# EAGLE design Rev1_1 (EAGLE 6.3)
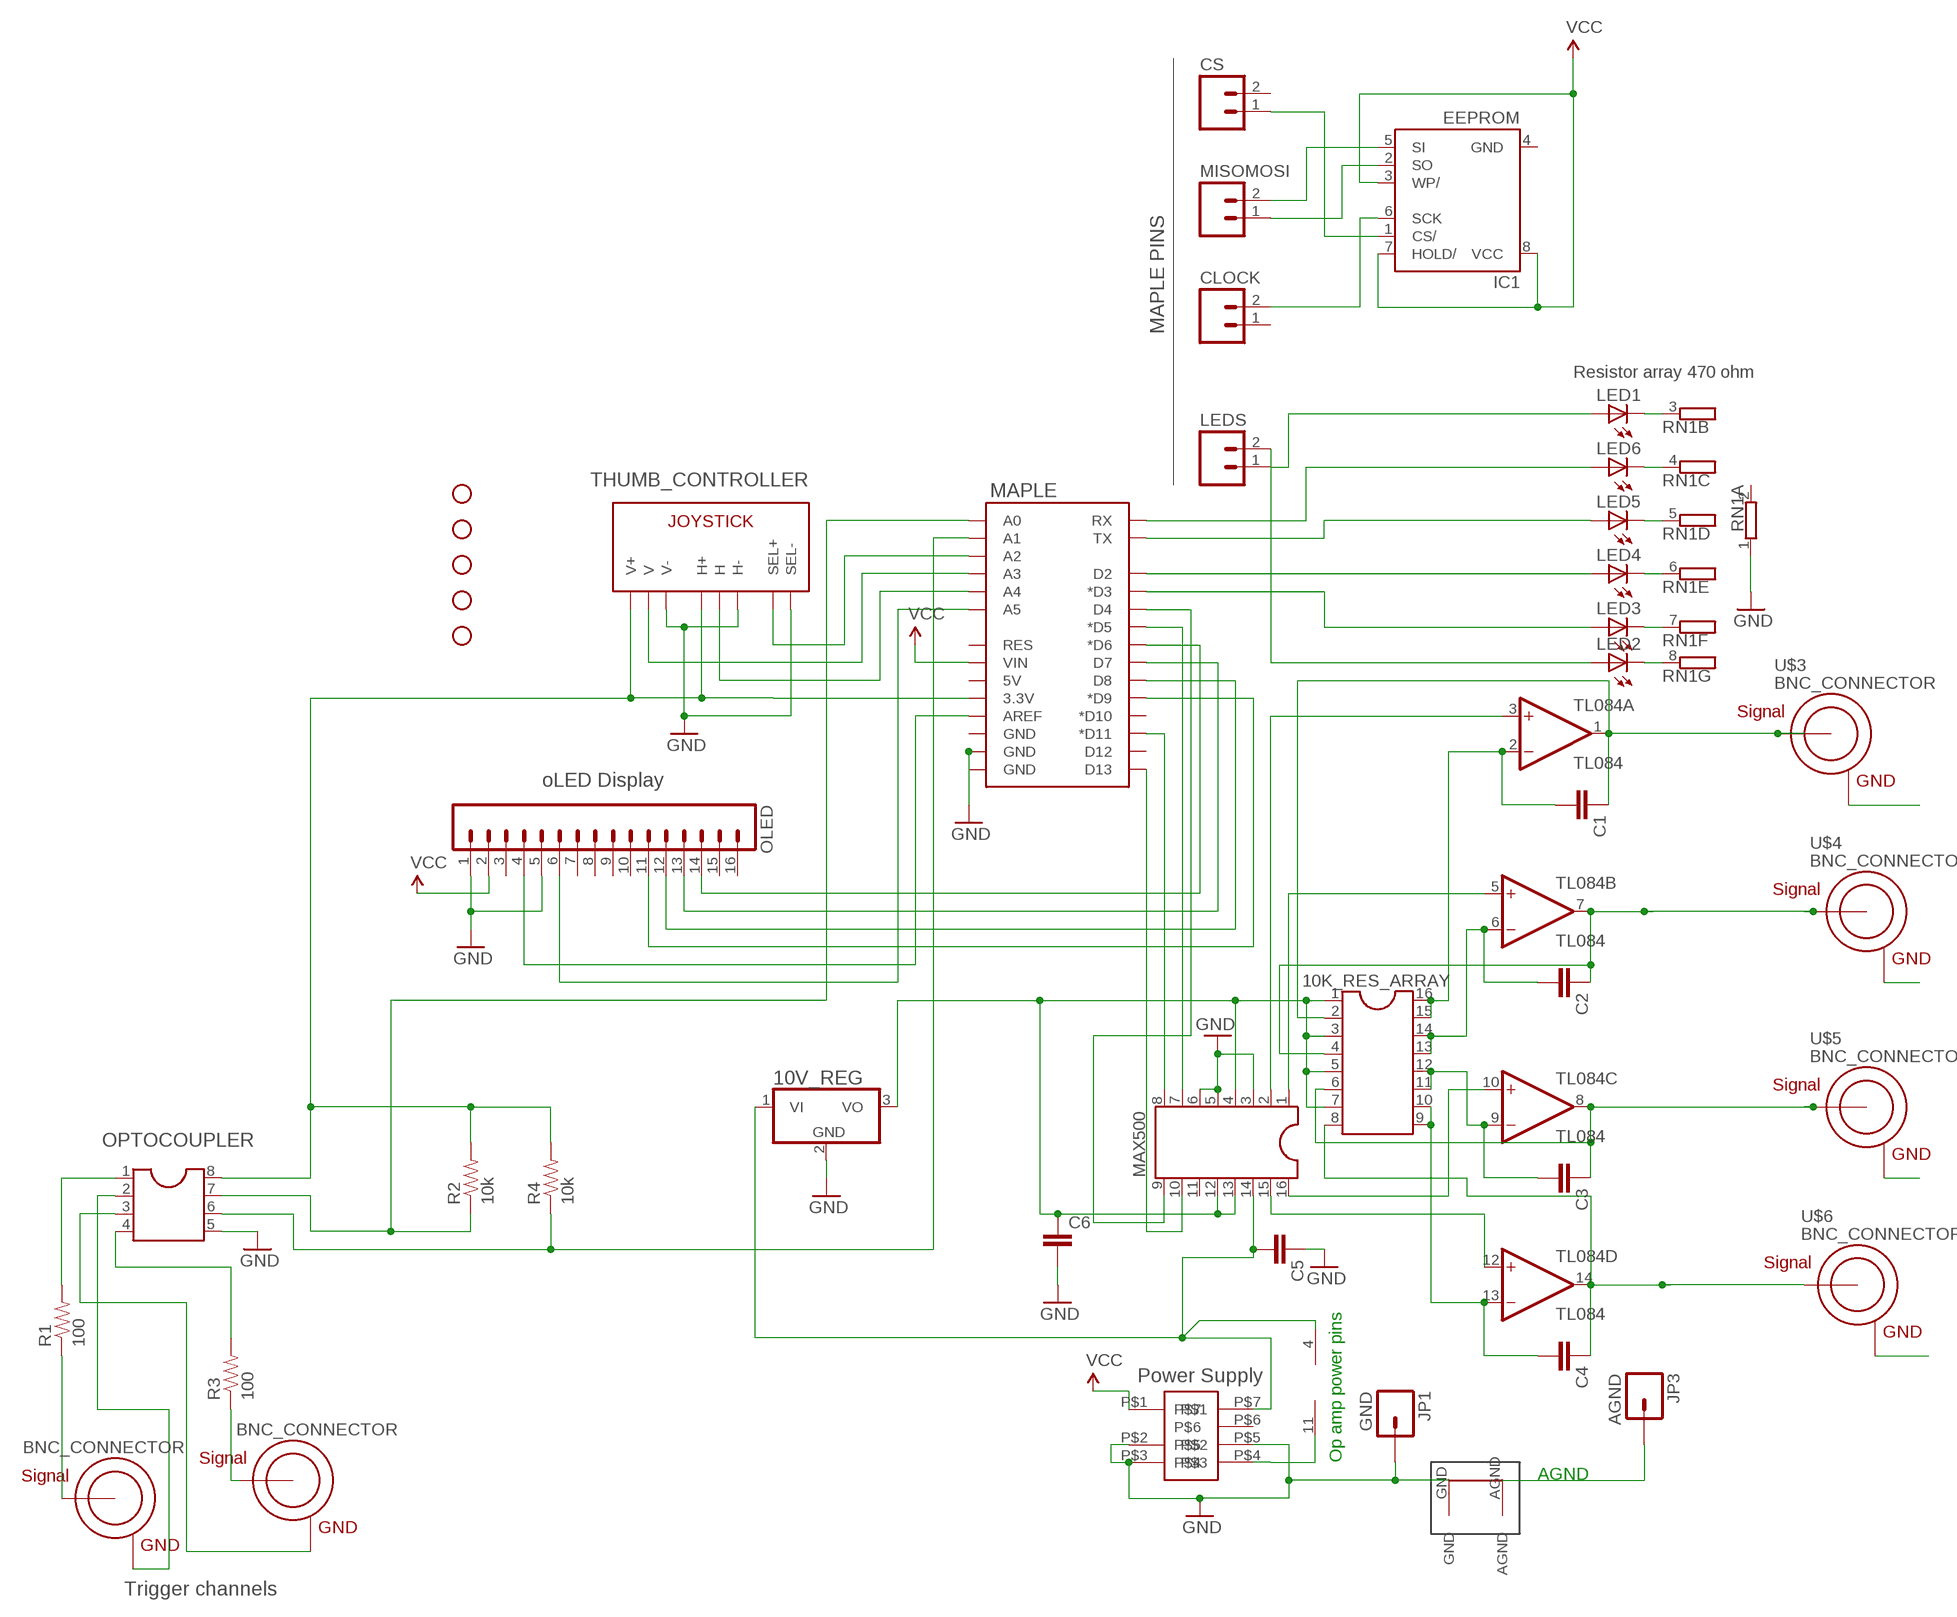
[diagram p0: schematic, sheet 1]

## Parts
10K_RES_ARRAY  DIL16  [DIL16]
10V_REG  7805T  [TO220H]
C1  CAPPTH  [CAP-PTH-SMALL]
C2  CAPPTH  [CAP-PTH-SMALL]
C3  CAPPTH  [CAP-PTH-SMALL]
C4  CAPPTH  [CAP-PTH-SMALL]
C5  CAPPTH  [CAP-PTH-SMALL]
C6  CAPPTH  [CAP-PTH-SMALL]
CLOCK  M02PTH  [1X02]
CS  M02PTH  [1X02]
IC1  EEPROM  AT25P  [DIL08]
JP1  GND  M01PTH  [1X01]
JP2  STAND-OFF  [STAND-OFF]
JP3  AGND  M01PTH  [1X01]
JP5  STAND-OFF  [STAND-OFF]
JP6  STAND-OFF  [STAND-OFF]
JP8  STAND-OFF  [STAND-OFF]
JP9  STAND-OFF  [STAND-OFF]
LED1  LED3MM  [LED3MM]
LED2  LED3MM  [LED3MM]
LED3  LED3MM  [LED3MM]
LED4  LED3MM  [LED3MM]
LED5  LED3MM  [LED3MM]
LED6  LED3MM  [LED3MM]
LEDS  M02PTH  [1X02]
MAPLE  ARDUINO_SHIELDNOHOLESORLABELS  [DUEMILANOVE_SHIELD_NOHOLES_NOLABELS]
MAX500  DIL16  [DIL16]
MISOMOSI  M02PTH  [1X02]
OLED  M16PTH  [1X16]
OPTOCOUPLER  DIL8  [DIL08]
R1  100  RESISTORAXIAL-0.3  [AXIAL-0.3]
R2  10k  RESISTORAXIAL-0.3  [AXIAL-0.3]
R3  100  RESISTORAXIAL-0.3  [AXIAL-0.3]
R4  10k  RESISTORAXIAL-0.3  [AXIAL-0.3]
RN1  GE07R  [SIL8]
THUMB_CONTROLLER  JOYSTICKPTH  [JOYSTICK]
TL084  TL084  TL084P  [DIL14]
U$1  BNC_CONNECTOR  [BNC_CONNECTOR]
U$2  BNC_CONNECTOR  [BNC_CONNECTOR]
U$3  BNC_CONNECTOR  [BNC_CONNECTOR]
U$4  BNC_CONNECTOR  [BNC_CONNECTOR]
U$5  BNC_CONNECTOR  [BNC_CONNECTOR]
U$6  BNC_CONNECTOR  [BNC_CONNECTOR]
U$7  GNDPLANESHRT  [GNDPLANESHRT]
U$8  TDK_LAMBDA_5_TO_BI_12_125MA  [TDK_LAMBDA_5_TO_BI_12_125MA]

## Nets
AGND: JP3.1 U$3.GND U$4.GND U$5.GND U$6.GND U$7.AGND
GND: 10V_REG.2(GND) C5.1 C6.2 JP1.1 MAPLE.GND@0(GND) MAPLE.GND@1(GND) MAX500.3 MAX500.5 MAX500.6 OLED.1 OLED.5 OPTOCOUPLER.5 RN1.1 THUMB_CONTROLLER.B2A(SEL-) THUMB_CONTROLLER.H3(H-) THUMB_CONTROLLER.V3(V-) U$7.GND U$8.P$2 U$8.P$3 U$8.P$5
N$1: LED6.A MAPLE.RX
N$2: LED5.A MAPLE.TX
N$3: LED4.A MAPLE.D2
N$4: LED3.A MAPLE.D3(*D3)
N$5: MAPLE.D11(*D11) MAX500.8
N$6: MAPLE.D13 MAX500.10
N$7: MAPLE.AREF OLED.4
N$8: MAPLE.D4 MAX500.9
N$9: MAPLE.D5(*D5) MAX500.7
N$10: MAPLE.D6(*D6) OLED.14
N$11: MAPLE.D7 OLED.13
N$12: MAPLE.D8 OLED.12
N$13: MAPLE.D9(*D9) OLED.11
N$14: MAPLE.A5 OLED.6
N$15: MAPLE.A4 THUMB_CONTROLLER.H2(H)
N$16: MAPLE.A3 THUMB_CONTROLLER.V2(V)
N$17: MAPLE.A2 THUMB_CONTROLLER.B1A(SEL+)
N$19: R1.P$1 U$1.SIGNAL
N$20: MAPLE.A0 OPTOCOUPLER.7 R2.P$1
N$21: R3.P$1 U$2.SIGNAL
N$22: MAPLE.A1 OPTOCOUPLER.6 R4.P$1
N$23: TL084.11(P:V-) U$8.P$4
N$24: MAX500.2 TL084.3(A:+IN)
N$25: MAX500.1 TL084.5(B:+IN)
N$28: 10V_REG.1(VI) C5.2 MAX500.14 TL084.4(P:V+) U$8.P$7
N$29: 10K_RES_ARRAY.1 10K_RES_ARRAY.3 10K_RES_ARRAY.5 10K_RES_ARRAY.7 10V_REG.3(VO) C6.1 MAX500.4 MAX500.12 MAX500.13
N$30: MAX500.16 TL084.10(C:+IN)
N$31: MAX500.15 TL084.12(D:+IN)
N$32: 10K_RES_ARRAY.2 C1.1 TL084.1(A:OUT) U$3.SIGNAL
N$33: 10K_RES_ARRAY.4 C2.1 TL084.7(B:OUT) U$4.SIGNAL
N$34: 10K_RES_ARRAY.6 C3.1 TL084.8(C:OUT) U$5.SIGNAL
N$35: 10K_RES_ARRAY.8 C4.1 TL084.14(D:OUT) U$6.SIGNAL
N$36: LED1.A LEDS.1
N$37: LED2.A LEDS.2
N$38: LED2.K(C) RN1.8
N$39: LED3.K(C) RN1.7
N$40: LED4.K(C) RN1.6
N$41: LED5.K(C) RN1.5
N$42: LED6.K(C) RN1.4
N$43: 10K_RES_ARRAY.15 10K_RES_ARRAY.16 C1.2 TL084.2(A:-IN)
N$44: 10K_RES_ARRAY.13 10K_RES_ARRAY.14 C2.2 TL084.6(B:-IN)
N$45: 10K_RES_ARRAY.11 10K_RES_ARRAY.12 C3.2 TL084.9(C:-IN)
N$46: 10K_RES_ARRAY.9 10K_RES_ARRAY.10 C4.2 TL084.13(D:-IN)
N$47: LED1.K(C) RN1.3
N$52: OPTOCOUPLER.1 R1.P$2
N$53: CS.1 IC1.1(CS/)
N$54: IC1.5(SI) MISOMOSI.2
N$55: IC1.2(SO) MISOMOSI.1
N$56: CLOCK.2 IC1.6(SCK)
N$57: OPTOCOUPLER.2 U$1.GND
N$58: OPTOCOUPLER.4 R3.P$2
N$60: OPTOCOUPLER.3 U$2.GND
N$61: MAPLE.3.3V OPTOCOUPLER.8 R2.P$2 R4.P$2 THUMB_CONTROLLER.H1(H+) THUMB_CONTROLLER.V1(V+)
VCC: IC1.3(WP/) IC1.7(HOLD/) IC1.8(VCC) MAPLE.VIN OLED.2 U$8.P$1
Unconnected: CLOCK.1 CS.2 MAPLE.5V MAPLE.D10(*D10) MAPLE.D12 MAPLE.GND@2(GND) MAPLE.RES MAX500.11 OLED.3 OLED.7 OLED.8 OLED.9 OLED.10 OLED.15 OLED.16 RN1.2 U$8.P$6

## Notes on the sheet
- MAPLE PINS
- Resistor array 470 ohm
- oLED Display
- Power Supply
- Op amp power pins
- AGND
- Trigger channels

## Power pins joined to a net without a drawn wire
GND: IC1.4(GND)

## Library data of the parts
10K_RES_ARRAY MAX500 = ic-package:DIL16: Dual In Line / Socket
10V_REG = linear:78*: Positive VOLTAGE REGULATOR Source: http://cache.national.com/ds/LM/LM78L05.pdf http://www.fairchildsemi.com/ds/LM/LM7805.pdf
C1-C6 = SparkFun:CAP: Capacitor Standard 0603 ceramic capacitor, and 0.1" leaded capacitor.
CLOCK CS LEDS MISOMOSI = SparkFun:M02: Header 2 Standard 2-pin 0.1" header. Use with straight break away headers (SKU : PRT-00116), right angle break away headers (PRT-00553), swiss pins (PRT-00743), machine pins (PRT-00117), and female headers (PRT-00115). Molex polarized connector foot print use with SKU : PRT-08233 with associated crimp pins and housings.
IC1 = atmel:AT25*: SPI bus serial EEPROM
JP1 JP3 = SparkFun-Connectors:M01: Header 1 Standard 1-pin 0.1" header. Use with straight break away headers (SKU : PRT-00116), right angle break away headers (PRT-00553), swiss pins (PRT-00743), machine pins (PRT-00117), and female headers (PRT-00115). SMTSO-256-ET is a "flush mount" nut for a 4-40 screw. The older package used to be too tight, and did not allow it to sit properly thru the drill hit. The latest (0.165DIA) fits nice and snug.
JP2 JP5 JP6 JP8 JP9 = SparkFun:STAND-OFF: Stand Off This is the mechanical footprint for a #4 phillips button head screw. Use the keepout ring to avoid running the screw head into surrounding components. SKU : PRT-00447
LED1-LED6 = SparkFun:LED: LEDs Standard schematic elements and footprints for 5mm, 3mm, 1206, and 0603 sized LEDs. 5mm - Spark Fun Electronics SKU : COM-00529 (and others)
MAPLE = SparkFun:ARDUINO_SHIELD
OLED = SparkFun:M16
OPTOCOUPLER = ic-package:DIL8: Dual In Line / Socket
R1-R4 = SparkFun:RESISTOR: Resistor Basic schematic elements and footprints for 0603, 1206, and PTH resistors.
RN1 = resistor-sil:GE07R: SIL RESISTOR
THUMB_CONTROLLER = SparkFun:JOYSTICK: Thumb Joystick Joystick commonly found in PS2 controllers. Two pots and a select switch. Footprint proven. Spark Fun Electronics SKU : COM-09032
TL084 = linear:TL084: OP AMP
U$1-U$6 = JoshParts:BNC_CONNECTOR
U$7 = Joshparts2:GNDPLANESHRT
U$8 = JoshParts:TDK_LAMBDA_5_TO_BI_12_125MA

## Net classes
0 default: width 0.203 mm
1 vcc: width 0.254 mm

## Board
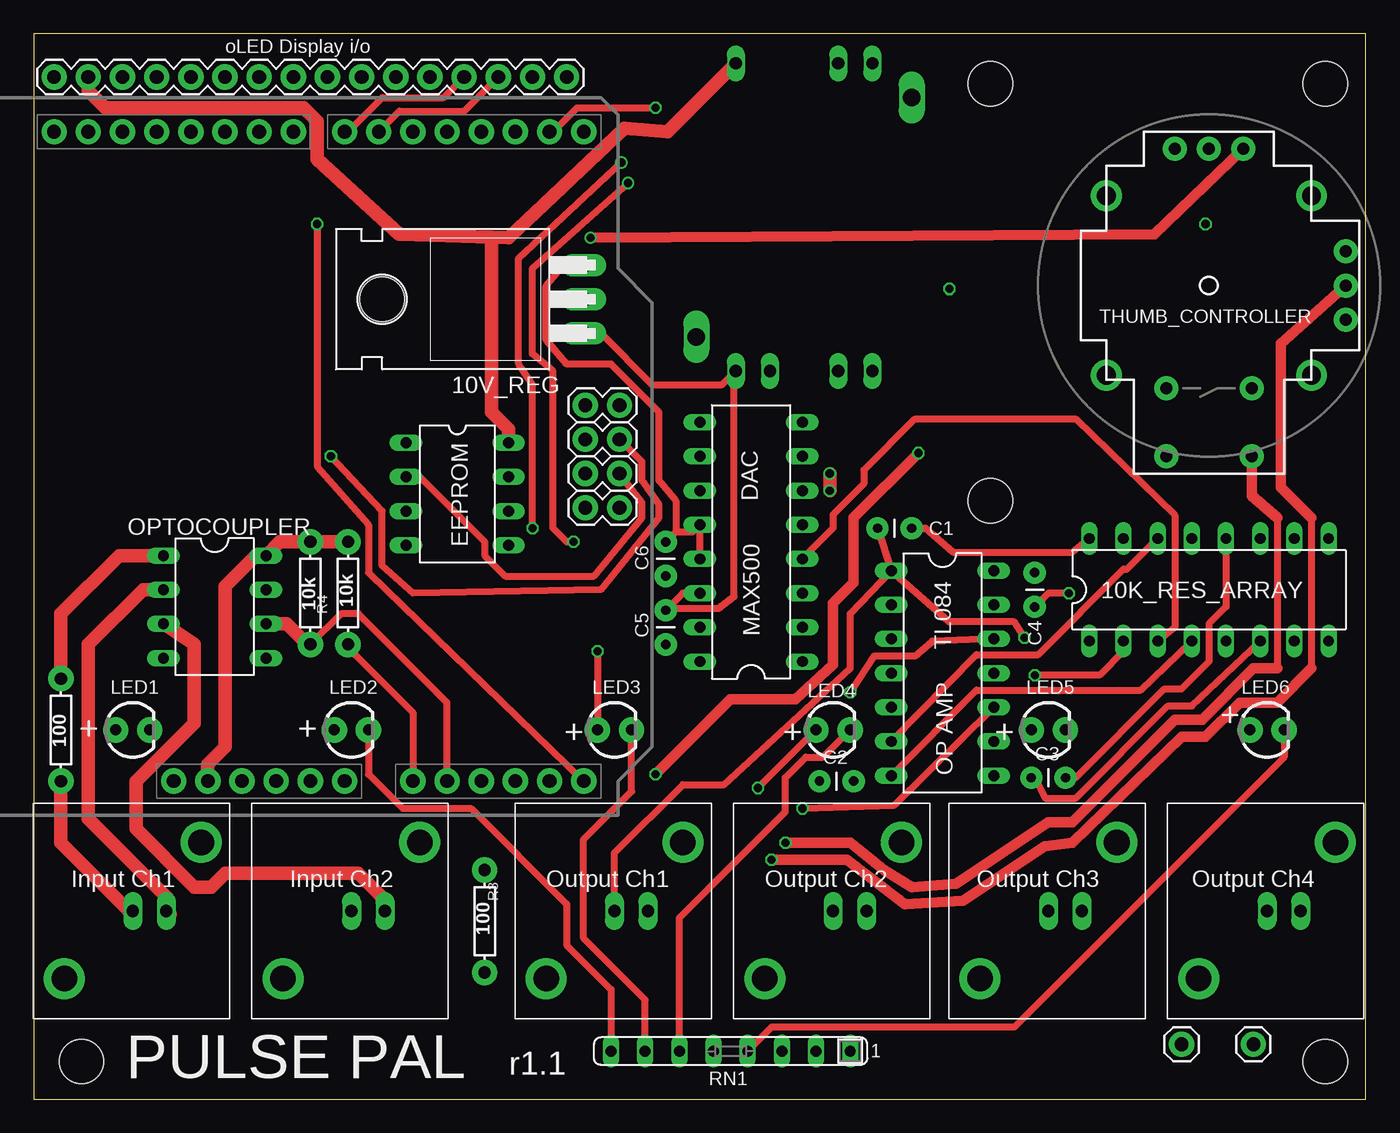
[diagram p1: board, top side]
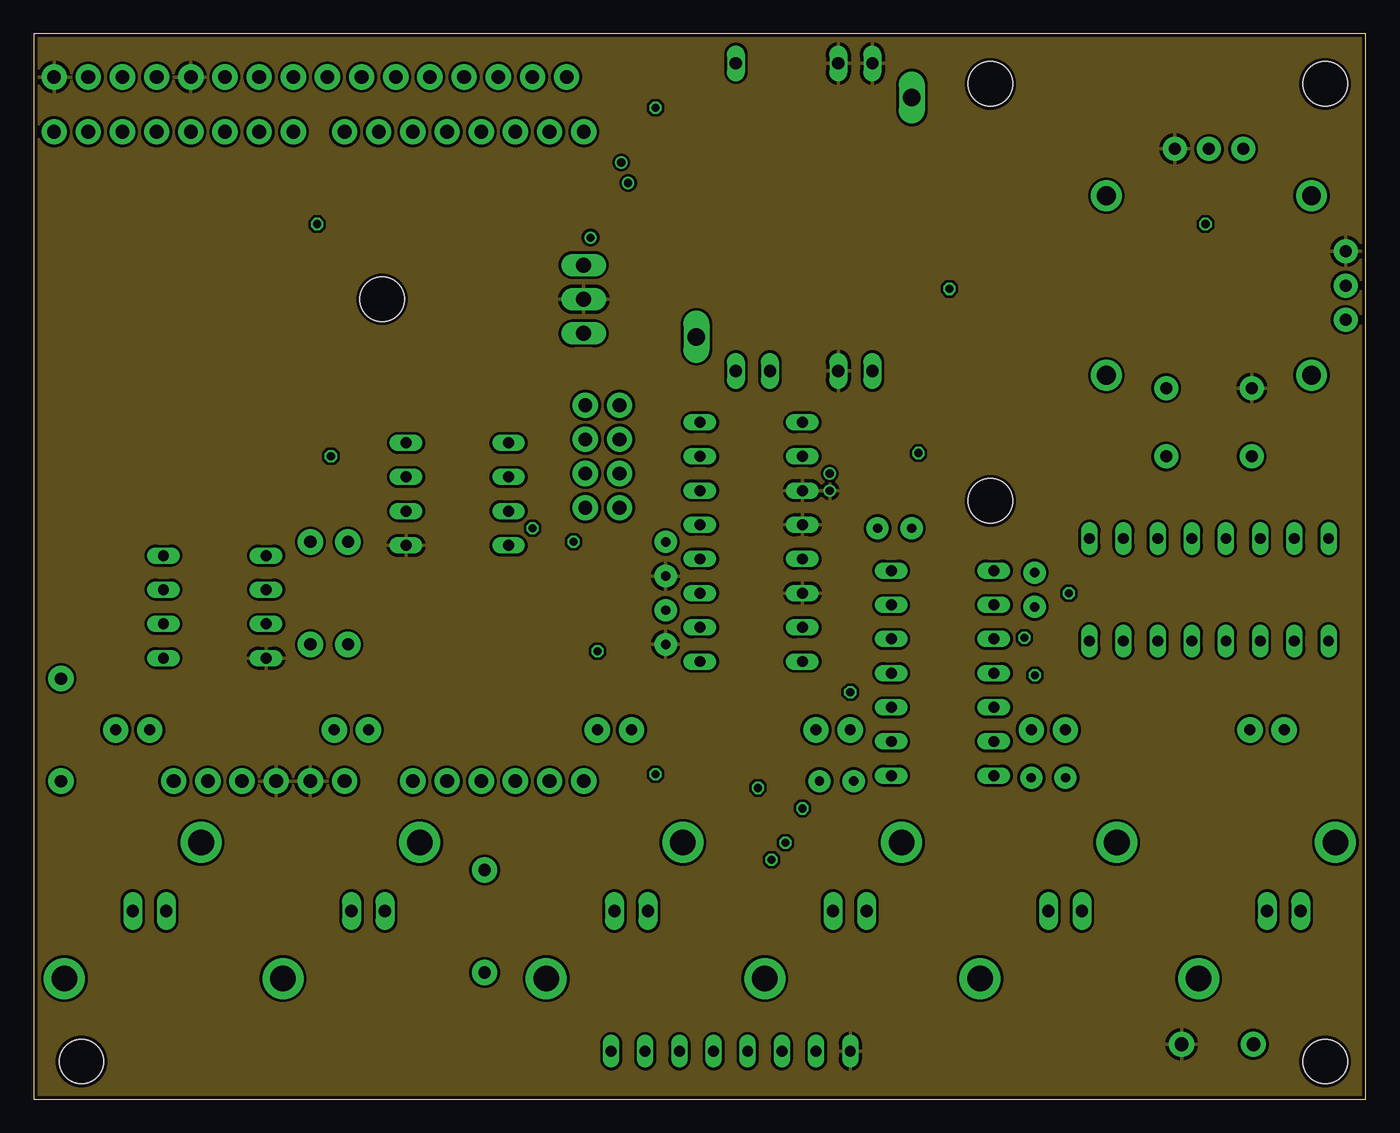
[diagram p2: board, inner layer Route2]
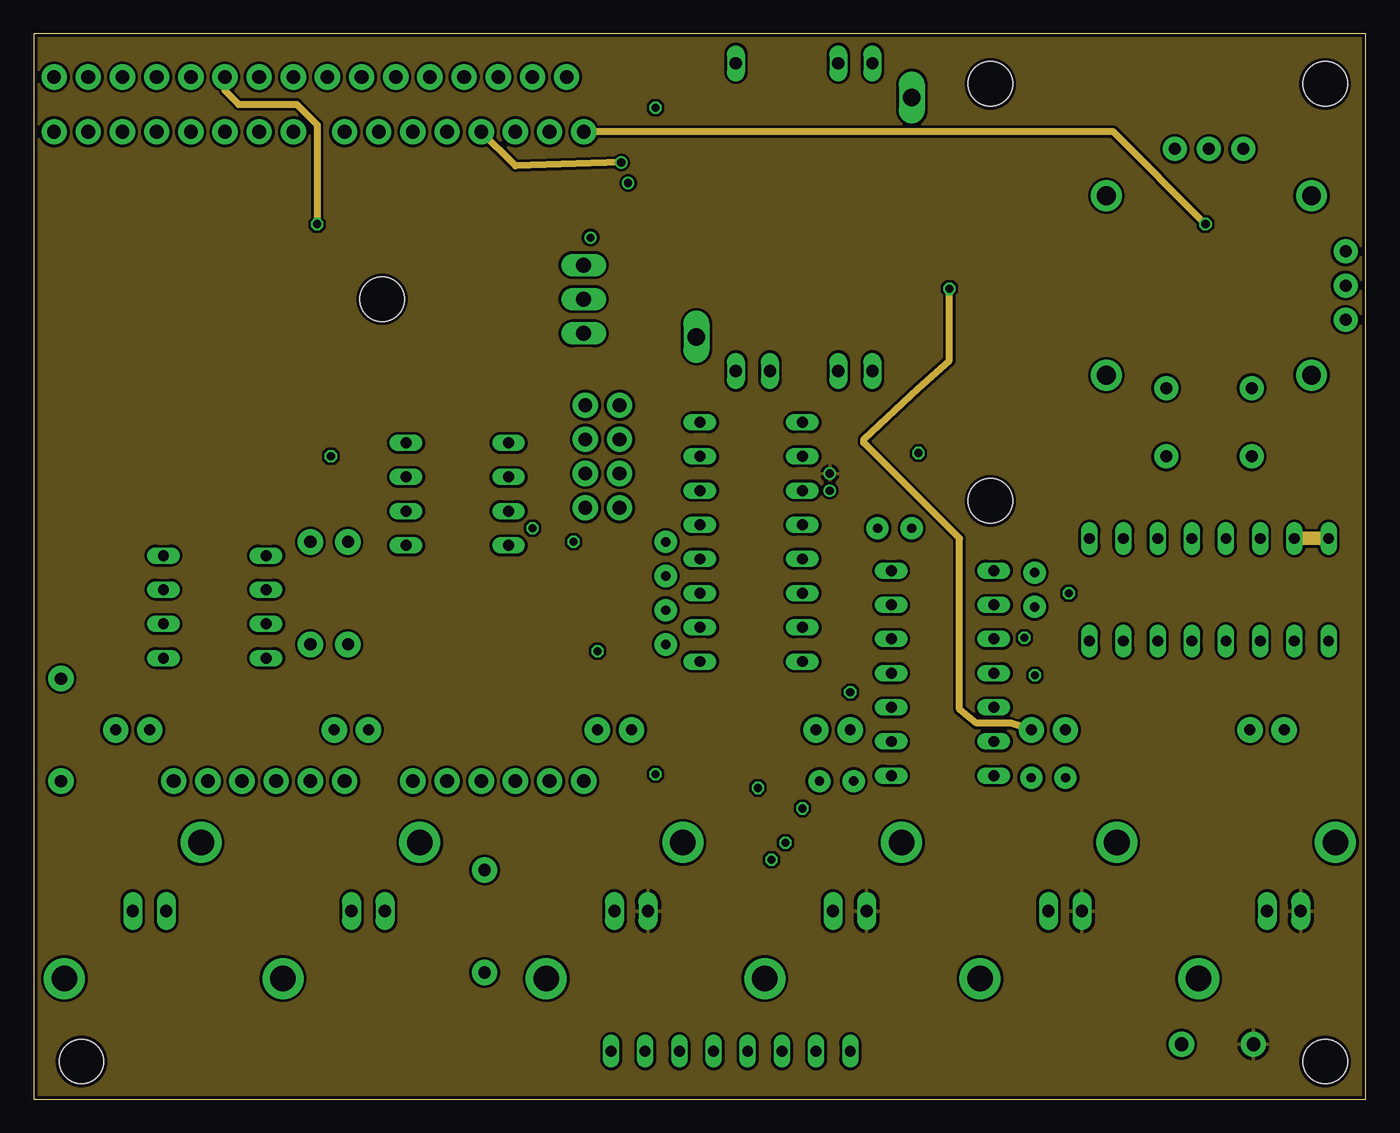
[diagram p3: board, inner layer Route15]
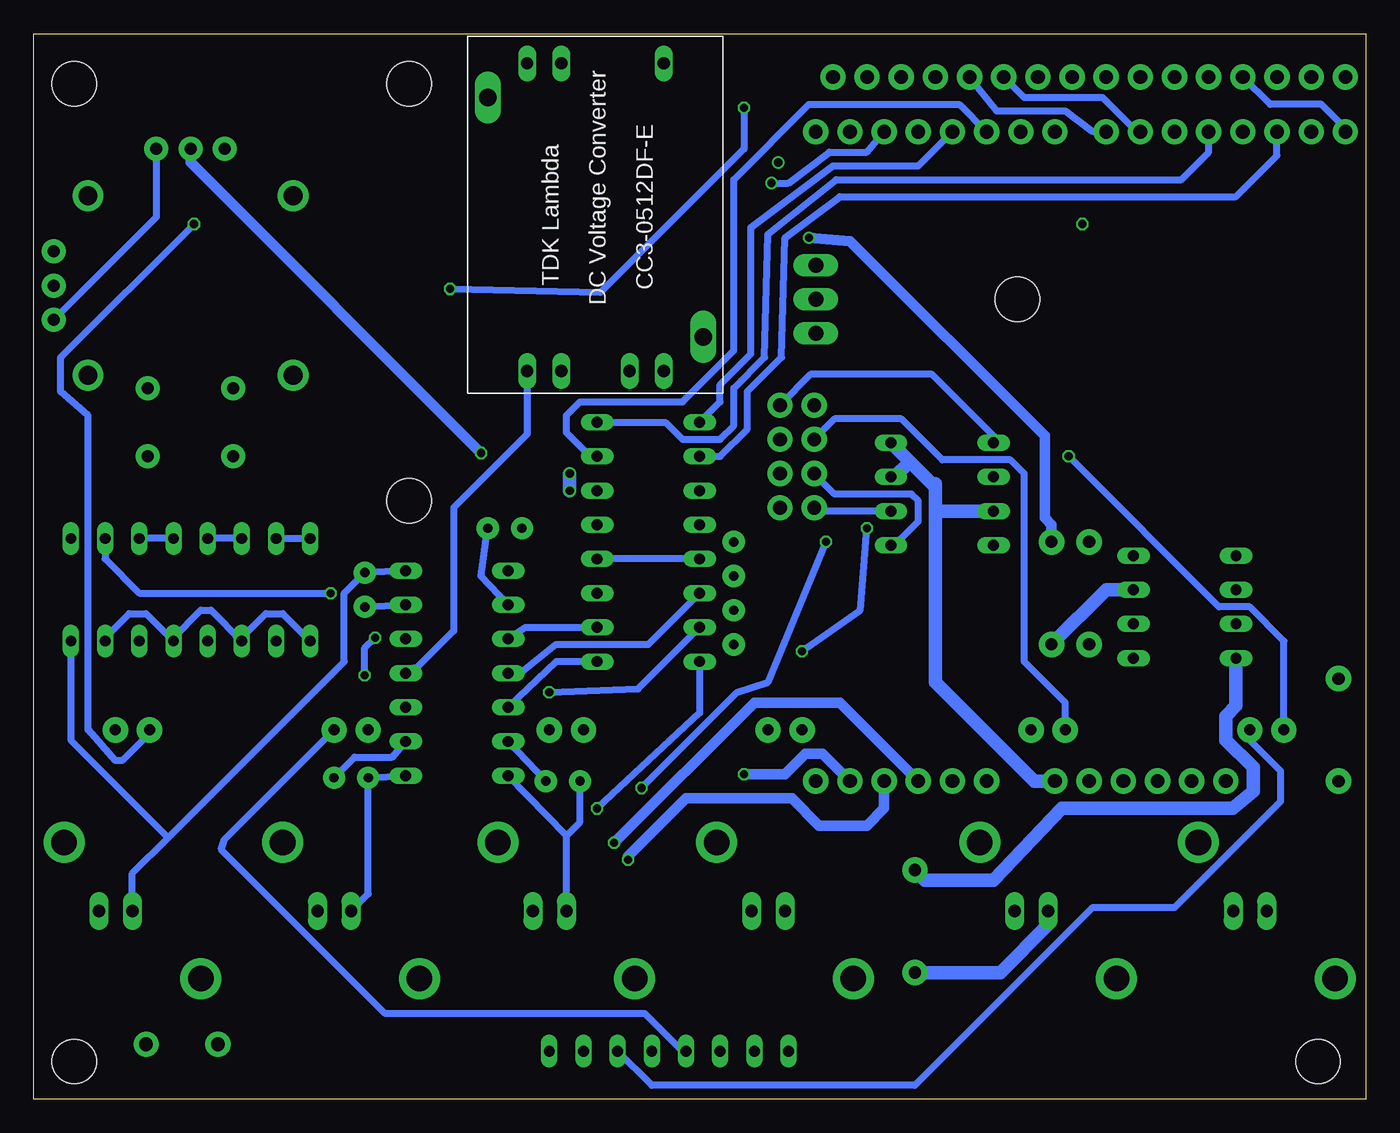
[diagram p4: board, bottom side, seen from below]

Size 99.04 x 79.17 mm. Coordinates in mm from the lower left corner, seen from the top.
Outline: 99.04,79.17 0,79.17 0,0 99.04,0 99.04,79.17
Copper layers (1*2*15*16): Top 0.035mm / dielectric 0.2mm / Route2 0.0175mm / dielectric 0.3mm / Route15 0.0175mm / dielectric 0.2mm / Bottom 0.035mm
Design rules "SeeedStudio_4layer_DRU_20140221": minimum track width 8mil, minimum drill 12mil, track to track 8mil, track to pad 8mil, pad to pad 8mil, via to via 8mil, smd to smd 0mil, copper to edge 10mil, drill to drill 8mil, minimum pad ring 6mil, minimum via ring 4mil, stop-mask expansion 4mil, vias tented up to drill 25mil, thermal gap 10mil

### Footprints (pad centres in the part's own frame; a part is rotated, then mirrored left to right if it is on the bottom)
DIL16 = drill 0.813 long: 1 -8.89,-3.81; 2 -6.35,-3.81; 3 -3.81,-3.81; 4 -1.27,-3.81; 5 1.27,-3.81; 6 3.81,-3.81; 7 6.35,-3.81; 8 8.89,-3.81; 9 8.89,3.81; 10 6.35,3.81; 11 3.81,3.81; 12 1.27,3.81; 13 -1.27,3.81; 14 -3.81,3.81; 15 -6.35,3.81; 16 -8.89,3.81
TO220H = drill 1.118 long: 1 -2.54,-10.16; 2 0,-10.16; 3 2.54,-10.16 | hole 3.302: 0,4.826
CAP-PTH-SMALL = drill 0.7 pad 1.651: 1 0,0; 2 2.54,0
1X02 = drill 1.016 pad 1.88: 1 0,0; 2 2.54,0
DIL08 = drill 0.813 long: 1 -3.81,-3.81; 2 -1.27,-3.81; 3 1.27,-3.81; 4 3.81,-3.81; 5 3.81,3.81; 6 1.27,3.81; 7 -1.27,3.81; 8 -3.81,3.81
1X01 = drill 1.016 pad 1.88: 1 0,0
STAND-OFF = hole 3.302: 0,0
LED3MM = drill 0.813 pad 1.88: A -1.27,0; K 1.27,0
DUEMILANOVE_SHIELD_NOHOLES_NOLABELS = drill 1.016 pad 1.88: 3.3V 50.8,26.67; 5V 50.8,29.21; A0 50.8,41.91; A1 50.8,44.45; A2 50.8,46.99; A3 50.8,49.53; A4 50.8,52.07; A5 50.8,54.61; AREF 2.54,15.24; D2 2.54,49.53; D3 2.54,46.99; D4 2.54,44.45; D5 2.54,41.91; D6 2.54,39.37; D7 2.54,36.83; D8 2.54,33.02; D9 2.54,30.48; D10 2.54,27.94; D11 2.54,25.4; D12 2.54,22.86; D13 2.54,20.32; GND@0 50.8,31.75; GND@1 50.8,34.29; GND@2 2.54,17.78; RES 50.8,24.13; RX 2.54,54.61; TX 2.54,52.07; VIN 50.8,36.83
1X16 = drill 1.016 pad 1.88: 1 0,0; 2 2.54,0; 3 5.08,0; 4 7.62,0; 5 10.16,0; 6 12.7,0; 7 15.24,0; 8 17.78,0; 9 20.32,0; 10 22.86,0; 11 25.4,0; 12 27.94,0; 13 30.48,0; 14 33.02,0; 15 35.56,0; 16 38.1,0
AXIAL-0.3 = drill 0.9 pad 1.88: P$1 -3.81,0; P$2 3.81,0
SIL8 = drill 0.813 long: 1 -8.89,0; 2 -6.35,0; 3 -3.81,0; 4 -1.27,0; 5 1.27,0; 6 3.81,0; 7 6.35,0; 8 8.89,0
JOYSTICK = drill 0.9 pad 1.778: B1A -3.175,12.7; B1B 3.175,12.7; B2A -3.175,7.62; B2B 3.175,7.62 | drill 0.889 pad 1.778: H1 -2.54,-10.16; H2 0,-10.16; H3 2.54,-10.16; V1 -10.16,2.54; V2 -10.16,0; V3 -10.16,-2.54 | drill 1.397 pad 2.286: MOUNT1 -7.62,6.668; MOUNT2 -7.62,-6.668; MOUNT3 7.62,-6.668; MOUNT4 7.62,6.668
DIL14 = drill 0.813 long: 1 -7.62,-3.81; 2 -5.08,-3.81; 3 -2.54,-3.81; 4 0,-3.81; 5 2.54,-3.81; 6 5.08,-3.81; 7 7.62,-3.81; 8 7.62,3.81; 9 5.08,3.81; 10 2.54,3.81; 11 0,3.81; 12 -2.54,3.81; 13 -5.08,3.81; 14 -7.62,3.81
BNC_CONNECTOR = drill 0.9 pad 1.422 long: GND -2.492,0; SIGNAL 0,0 | drill 1.9 pad 3.048: P$3 5.076,5.025; P$4 -5.089,-5.102
GNDPLANESHRT = drill 0.6: AGND -1.27,0; GND 0,0
TDK_LAMBDA_5_TO_BI_12_125MA = drill 0.9 long: P$1 0,-2.92; P$2 0,-10.54; P$3 0,-13.08; P$4 22.86,-13.08; P$5 22.86,-10.54; P$6 22.86,-5.46; P$7 22.86,-2.92 | drill 1.3 long: P$8 20.32,0; P$9 2.54,-16

### Placement (x,y rotation side)
10K_RES_ARRAY  87.38,37.85 0 top
10V_REG  30.73,59.44 90 top
C1  62.74,42.42 0 top
C2  58.42,23.62 0 top
C3  74.17,23.88 0 top
C4  74.42,39.12 270 top
C5  46.99,33.78 90 top
C6  46.99,41.4 270 top
CLOCK  43.56,43.94 180 top
CS  43.56,51.56 180 top
IC1  31.5,44.96 270 top
JP1  85.34,4.06 0 top
JP2  71.12,75.44 0 top
JP3  90.68,4.06 0 top
JP5  96.01,2.79 0 top
JP6  96.01,75.44 0 top
JP8  71.12,44.45 0 top
JP9  3.56,2.79 0 top
LED1  7.37,27.43 0 top
LED2  23.62,27.43 0 top
LED3  43.18,27.43 0 top
LED4  59.44,27.43 0 top
LED5  75.44,27.43 0 top
LED6  91.69,27.43 0 top
LEDS  43.56,49.02 180 top
MAPLE  -13.72,74.42 270 top
MAX500  53.34,41.4 90 top
MISOMOSI  43.56,46.48 180 top
OLED  1.52,75.95 0 top
OPTOCOUPLER  13.46,36.58 270 top
R1  2.03,27.43 90 top
R2  23.37,37.59 90 top
R3  33.53,13.21 90 top
R4  20.57,37.59 90 top
RN1  51.82,3.56 180 top
THUMB_CONTROLLER  87.38,60.45 180 top
TL084  67.56,31.65 270 top
U$1  7.37,13.97 180 top
U$2  23.62,13.97 180 top
U$3  43.18,13.97 180 top
U$4  59.44,13.97 180 top
U$5  75.44,13.97 180 top
U$6  91.69,13.97 180 top
U$7  59.18,45.21 270 top
U$8  49.28,76.96 270 bottom

### Tracks (layer width: path | path; a pad name or v marks a point on that pad's centre or on a via)
AGND
  Top 1.016: U$7.AGND 59.18,45.21
  Bottom 1.016: U$7.AGND 59.18,45.21
  pour Route15: 0,79.25 0,0 99.06,0 99.06,79.25
GND
  pour Route2: 0,79.25 0,0 99.06,0 99.06,79.25
N$1  (via drill 0.6)
  Route15 0.508: v87.12,65.02 80.26,71.88 MAPLE.RX
  Bottom 0.508: LED6.A 90.42,27.18 92.46,25.15 92.96,25.15 95,27.43 95,50.8 97.03,52.58 97.03,55.12 v87.12,65.02
N$2  (via drill 0.6)
  Top 0.508: MAPLE.TX 38.61,71.88 40.39,73.66 v46.23,73.66
  Route15 0.508: LED5.A 72.64,27.94 70.1,27.94 68.83,28.96 68.83,41.66 61.72,48.77 61.72,49.02 65.79,52.83 68.07,54.86 v68.07,60.2
  Bottom 0.508: v46.23,73.66 46.23,70.61 56.9,59.94 v68.07,60.2
N$3  (via drill 0.6)
  Top 0.508: LED4.A v53.85,23.11 | v40.13,41.4 39.62,41.4 38.61,42.42 38.61,54.1 37.08,55.37 37.08,61.72 v44.2,68.07
  Bottom 0.508: v53.85,23.11 46.74,30.23 44.45,30.99 v40.13,41.4 | v44.2,68.07 42.93,68.07 39.88,70.36 37.08,70.36 MAPLE.D2
N$4  (via drill 0.6)
  Top 0.508: v37.08,42.42 37.08,53.09 36.07,54.61 36.07,62.48 v43.69,69.6 | v41.91,33.27 LED3.A
  Route15 0.508: v43.69,69.6 35.81,69.34 MAPLE.D3
  Bottom 0.508: v41.91,33.27 37.59,36.32 v37.08,42.42
N$5
  Bottom 0.508: MAX500.8 52.07,50.29 50.8,49.02 48.01,49.02 46.99,50.04 46.99,52.83 44.7,55.12 44.45,64.26 39.37,68.33 13.72,68.33 11.68,70.36 MAPLE.D11
N$6
  Bottom 0.508: MAX500.10 48.01,47.75 45.97,49.78 45.97,52.58 43.43,55.12 43.18,64.01 39.12,67.06 9.65,67.06 6.6,70.1 MAPLE.D13
N$7
  Bottom 0.508: MAPLE.AREF 1.52,72.14 3.3,73.91 7.11,73.91 OLED.4
N$8
  Bottom 0.508: MAX500.9 48.01,51.82 48.01,53.09 45.72,55.37 45.72,64.77 39.62,69.34 33.27,69.34 MAPLE.D4
N$9
  Bottom 0.508: MAX500.7 57.66,47.75 59.44,49.53 59.44,50.8 58.42,51.82 50.8,51.82 46.99,55.63 46.99,68.33 41.4,73.91 30.23,73.91 MAPLE.D5
N$10
  Top 0.508: MAPLE.D6 27.18,73.41 32,73.41 OLED.14
N$11
  Top 0.508: MAPLE.D7 23.37,71.88 25.91,74.42 30.48,74.42 OLED.13
N$12
  Bottom 0.508: MAPLE.D8 20.32,71.88 22.35,73.41 27.43,73.41 OLED.12
N$13
  Bottom 0.508: MAPLE.D9 17.02,71.88 19.56,74.42 25.4,74.42 OLED.11
N$14  (via drill 0.6)
  Top 0.508: v21.08,65.02 21.08,46.99 24.89,42.67 24.89,39.12 MAPLE.A5
  Route15 0.508: OLED.6 14.22,74.93 15.24,73.91 19.56,73.91 21.08,72.39 v21.08,65.02
N$15  (via drill 0.6)
  Top 0.762: v65.79,48.01 60.96,43.18 60.96,38.35 59.44,36.83 59.44,32.26 56.64,29.72 51.82,29.72 v46.23,24.13
  Bottom 0.762: THUMB_CONTROLLER.H2 87.38,69.6 v65.79,48.01 | v46.23,24.13 43.18,24.13 41.66,25.65 40.39,25.65 MAPLE.A4
N$16  (via drill 0.6)
  Top 0.508: 95,43.18 95,32
  Top 0.762: THUMB_CONTROLLER.V2 97.28,60.2 92.71,56.13 92.71,45.47 95,43.18 | v54.86,17.78 60.45,17.78 64.77,14.48 69.09,14.73 75.18,18.8 77.22,19.05 85.34,26.92 87.12,26.92 89.66,29.46 92.46,29.46 95,32
  Bottom 0.762: v54.86,17.78 54.86,18.03 50.55,22.35 42.67,22.35 40.64,20.32 37.08,20.32 35.81,21.59 MAPLE.A3
N$17  (via drill 0.6)
  Top 0.508: 92.46,43.18 92.46,32
  Top 0.762: THUMB_CONTROLLER.B1A 90.55,44.83 92.46,43.18 | v55.88,19.05 60.71,19.05 63.25,17.02 65.28,15.75 68.58,16 75.44,20.57 77.22,20.57 84.84,28.19 86.87,28.19 90.68,32 92.46,32
  Bottom 0.762: v55.88,19.05 45.47,29.46 39.12,29.46 MAPLE.A2
N$19
  Top 1.016: U$1.SIGNAL 7.11,13.97 2.03,19.05 R1.P$1
N$20
  Top 0.508: R2.P$1 23.37,33.53 28.19,28.7 MAPLE.A0
  Bottom 1.016: OPTOCOUPLER.7 19.3,37.85 R2.P$1
N$21
  Bottom 1.016: R3.P$1 27.18,9.4 23.62,12.95 U$2.SIGNAL
N$22
  Top 0.508: MAPLE.A1 30.73,29.46 24.13,36.07 22.86,36.07 R4.P$1
  Top 1.016: R4.P$1 20.32,33.78 18.8,35.31 OPTOCOUPLER.6
N$23
  Bottom 0.508: U$8.P$4 62.36,49.4 67.82,43.94 67.82,34.8 70.61,32 70.87,32 TL084.11
N$24
  Bottom 0.508: TL084.3 62.48,35.05 MAX500.2
N$25
  Bottom 0.508: MAX500.1 60.2,32.51 TL084.5
N$28
  Top 0.508: 50.04,37.59 MAX500.14 48.26,37.59 47.12,36.45 | 10V_REG.1 42.16,56.9 45.97,53.09 51.18,53.09 U$8.P$7 52.07,53.98 52.07,37.34 50.93,36.45 47.12,36.45 | 47.12,36.45 C5.2
  Bottom 0.508: TL084.4 62.74,31.75 60.2,33.78 53.34,33.78 MAX500.14
N$29
  Top 0.508: MAX500.13 MAX500.12 49.02,42.16 47.75,42.16 | 10V_REG.3 39.37,61.98 38.1,60.45 38.1,56.39 39.62,54.61 42.93,54.61 46.48,51.05 46.48,45.97 47.75,44.45 47.75,42.16 | 10K_RES_ARRAY.3 84.84,35.05 84.84,43.43 77.47,50.55 65.53,50.55 61.72,46.74 61.72,45.72 59.44,43.43 59.44,42.42 MAX500.4 | 47.75,42.16 C6.1
  Bottom 0.508: 10K_RES_ARRAY.7 93.73,34.29 91.95,36.07 90.68,36.07 10K_RES_ARRAY.5 88.65,34.29 86.61,36.32 85.85,36.32 10K_RES_ARRAY.3 83.57,34.29 81.79,36.07 80.52,36.07 10K_RES_ARRAY.1 | MAX500.13 MAX500.4
N$30  (via drill 0.6)
  Top 0.508: v57.15,21.59 64.01,21.84 TL084.10
  Bottom 0.508: MAX500.16 49.53,28.7 v57.15,21.59
N$31  (via drill 0.6)
  Top 0.508: TL084.12 66.8,34.04 65.53,32.92 62.48,32.92 v60.71,30.23
  Bottom 0.508: v60.71,30.23 54.1,30.48 MAX500.15
N$32  (via drill 0.6)
  Top 0.508: U$3.SIGNAL 43.18,18.29 48.26,23.37 51.31,23.37 60.71,32 60.71,36.07 TL084.1 | C1.1 TL084.1 | 10K_RES_ARRAY.2 81.03,33.27 79.25,31.5 v74.42,31.5 | v73.66,34.29 72.9,35.46 68.07,35.46 TL084.1
  Bottom 0.508: v74.42,31.5 74.42,33.53 v73.66,34.29
N$33
  Top 0.508: TL084.7 70.1,30.38 82.3,30.38 10K_RES_ARRAY.4
  Bottom 0.508: U$4.SIGNAL 59.44,19.56 | 59.44,19.56 TL084.7 | 59.44,19.56 58.42,20.57 C2.1
N$34
  Top 0.508: C3.1 74.42,23.88 75.18,22.35 77.47,22.35 84.33,29.21 86.11,29.21 10K_RES_ARRAY.6
  Bottom 0.508: U$5.SIGNAL 74.17,15.24 C3.1 TL084.8
N$35
  Bottom 0.508: TL084.14 C4.1 75.95,37.59 75.95,32.51 89.03,19.43 | U$6.SIGNAL 91.69,16.76 89.03,19.43 | 10K_RES_ARRAY.8 96.27,26.67 89.03,19.43
N$36  (via drill 0.6)
  Top 0.508: LEDS.1 45.21,47.37 45.21,45.97 46.48,44.2 46.48,43.18 42.16,37.85 28.19,37.59 25.91,39.62 25.91,43.69 v22.1,47.75
  Bottom 0.508: v22.1,47.75 10.92,36.58 8.64,36.58 6.1,34.04 LED1.A
N$37
  Bottom 0.508: LED2.A 22.35,29.46 25.4,32.51 25.4,46.48 26.42,47.5 31.5,47.5 34.54,50.55 39.5,50.55 LEDS.2
N$38
  Top 0.508: LED2.K 24.89,24.13 27.43,21.59 32.51,21.59 39.62,14.48 39.62,11.43 42.93,8.13 RN1.8
N$39
  Top 0.508: RN1.7 45.47,7.37 40.89,11.94 40.89,19.3 44.45,22.86 LED3.K
N$40
  Top 0.508: RN1.6 48.01,13.46 55.88,21.34 55.88,23.88 57.4,25.4 58.67,25.4 LED4.K
N$41
  Bottom 0.508: RN1.5 50.8,3.56 53.59,6.35 72.9,6.35 85.09,18.54 84.84,19.3 LED5.K
N$42
  Top 0.508: LED6.K 92.96,25.4 72.9,5.33 54.86,5.33 RN1.4
N$43
  Top 0.508: C1.2 66.29,42.42 68.33,40.64 77.22,40.64 10K_RES_ARRAY.16
  Bottom 0.508: TL084.2 65.79,38.86 C1.2 | 10K_RES_ARRAY.15 10K_RES_ARRAY.16
N$44
  Top 0.508: TL084.6 70.1,33.02 74.68,33.02 81.03,39.37 81.28,39.37 10K_RES_ARRAY.14
  Bottom 0.508: C2.2 TL084.6 | 10K_RES_ARRAY.14 10K_RES_ARRAY.13
N$45
  Top 0.508: 10K_RES_ARRAY.12 88.65,36.58 87.38,35.31 87.38,32.51 85.34,30.48 84.07,30.48 77.47,23.88 C3.2
  Bottom 0.508: C3.2 75.18,25.4 72.39,25.4 TL084.9 | 10K_RES_ARRAY.12 10K_RES_ARRAY.11
N$46  (via drill 0.6)
  Top 0.508: v76.96,37.59 75.44,37.59 C4.2
  Route15 1.016: 10K_RES_ARRAY.10 10K_RES_ARRAY.9
  Bottom 0.508: C4.2 TL084.13 | 10K_RES_ARRAY.10 93.73,40.13 91.19,37.59 v76.96,37.59
N$47
  Bottom 0.508: LED1.K 8.64,26.67 6.35,24.38 6.35,22.1 14.22,14.22 20.32,14.22 33.53,1.02 53.09,1.02 RN1.3
N$52
  Top 1.016: R1.P$2 2.03,36.07 6.35,40.39 OPTOCOUPLER.1
N$53
  Bottom 0.508: IC1.1 27.69,49.28 32.26,53.85 41.27,53.85 CS.1
N$54
  Bottom 0.508: IC1.5 35.05,41.15 33.27,42.93 33.27,44.45 33.78,44.96 39.5,44.96 MISOMOSI.2
N$55
  Top 0.508: IC1.2 28.7,46.23 33.53,41.4 33.53,40.39 35.05,38.86 41.66,38.86 45.21,43.18 45.21,44.32 MISOMOSI.1
N$56
  Bottom 0.508: IC1.6 40.77,43.69 CLOCK.2
N$57
  Top 1.016: OPTOCOUPLER.2 8.13,37.85 4.06,33.78 4.06,20.83 9.91,14.99 9.91,13.97 10.16,13.72 10.11,13.72 U$1.GND
N$58
  Bottom 1.016: OPTOCOUPLER.4 9.65,29.21 10.41,28.45 10.41,26.67 8.38,24.64 8.38,22.86 9.91,21.59 22.61,21.59 27.69,16.26 32.77,16.26 R3.P$2
N$60
  Top 1.016: U$2.GND 26.11,14.78 24.13,16.76 14.22,16.76 13.21,15.75 11.94,15.75 7.62,20.07 7.62,23.62 11.94,27.94 11.94,33.78 OPTOCOUPLER.3
N$61  (via drill 0.6)
  Top 0.762: v41.4,64.01 83.31,64.26 THUMB_CONTROLLER.H1
  Top 1.016: R2.P$2 R4.P$2 18.29,41.4 OPTOCOUPLER.8 16.51,40.39 14.22,38.1 14.22,26.16 12.95,24.89 MAPLE.3.3V
  Bottom 0.508: THUMB_CONTROLLER.H1 89.92,65.53 THUMB_CONTROLLER.V1
  Bottom 0.762: R2.P$2 23.37,42.67 23.88,43.18 23.88,49.28 38.35,63.75 v41.4,64.01
VCC
  Top 1.016: IC1.7 35.05,46.23 | U$8.P$1 47.12,71.88 43.94,72.14 35.31,64.01 34.03,64.05 | OLED.2 4.06,74.93 5.33,73.66 20.07,73.66 21.08,72.64 21.08,69.85 27.18,64.26 34.03,64.05 | IC1.8 35.31,49.78 34.04,51.05 34.04,64.04 34.03,64.05
  Bottom 1.016: MAPLE.VIN 24.64,23.62 32,30.99 32,43.94 | 32,43.94 32,45.72 32.26,45.72 33.91,47.37 | 33.91,47.37 IC1.8 | IC1.7 35.05,46.23 33.91,47.37 | IC1.3 31.75,43.69 32,43.94

### Text on the board
tPlace: oLED Display i/o | DAC | R4 | OP AMP | + | + | + | + | + | + | Input Ch1 | Input Ch2 | Output Ch1 | Output Ch2 | Output Ch3 | Output Ch4 | R3 | PULSE PAL | r1.1